# Altium schematic sheet DUO_X.SchDoc
size A3; SheetNumber: 1; SheetTotal: 8
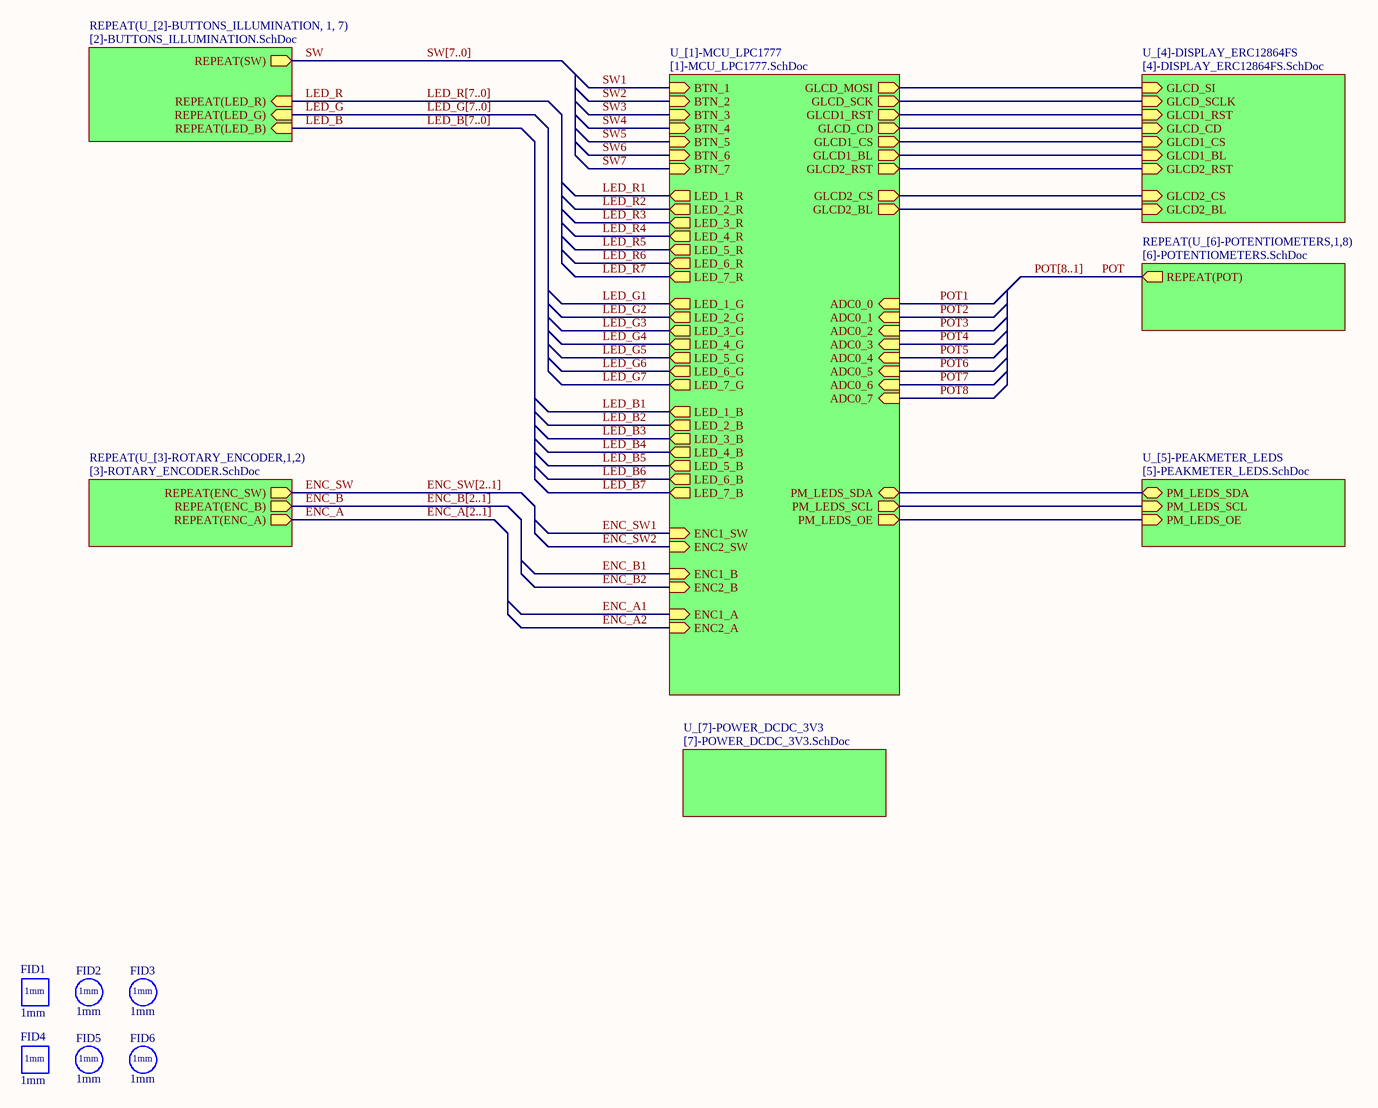
[diagram p0: DUO_X.SchDoc]

## Parts
FID1  1mm  [FID_1X2MM_R]
FID2  1mm  [FID_1X2MM_C]
FID3  1mm  [FID_1X2MM_C]
FID4  1mm  [FID_1X2MM_R]
FID5  1mm  [FID_1X2MM_C]
FID6  1mm  [FID_1X2MM_C]

## Sub-sheets
REPEAT(U_[2]-BUTTONS_ILLUMINATION, 1, 7) = [2]-BUTTONS_ILLUMINATION.SchDoc: REPEAT(SW) (out), REPEAT(LED_R) (in), REPEAT(LED_B) (in), REPEAT(LED_G) (in)
REPEAT(U_[3]-ROTARY_ENCODER,1,2) = [3]-ROTARY_ENCODER.SchDoc: REPEAT(ENC_SW) (out), REPEAT(ENC_B) (out), REPEAT(ENC_A) (out)
REPEAT(U_[6]-POTENTIOMETERS,1,8) = [6]-POTENTIOMETERS.SchDoc: REPEAT(POT) (out)
U_[1]-MCU_LPC1777 = [1]-MCU_LPC1777.SchDoc: ADC0_1 (in), ADC0_0 (in), ADC0_2 (in), ADC0_3 (in), ADC0_5 (in), ADC0_4 (in), ADC0_6 (in), ADC0_7 (in), GLCD_SCK (out), GLCD_MOSI (out), GLCD1_CS (out), GLCD1_BL (out), GLCD2_CS (out), GLCD2_RST (out), GLCD2_BL (out), PM_LEDS_OE (out), PM_LEDS_SCL (out), PM_LEDS_SDA (bidir), LED_1_R (out), LED_1_G (out), LED_1_B (out), BTN_1 (in), LED_2_R (out), LED_2_G (out), LED_2_B (out), BTN_2 (in), BTN_3 (in), LED_3_R (out), LED_3_G (out), LED_3_B (out), LED_4_R (out), LED_4_G (out), LED_4_B (out), BTN_4 (in), LED_5_R (out), LED_5_G (out), LED_5_B (out), BTN_5 (in), LED_6_R (out), LED_6_G (out), LED_6_B (out), BTN_6 (in), LED_7_R (out), LED_7_G (out), LED_7_B (out), BTN_7 (in), ENC1_A (in), ENC1_B (in), ENC1_SW (in), ENC2_A (in), ENC2_B (in), ENC2_SW (in), GLCD1_RST (out), GLCD_CD (out)
U_[4]-DISPLAY_ERC12864FS = [4]-DISPLAY_ERC12864FS.SchDoc: GLCD_SI (in), GLCD_SCLK (in), GLCD1_RST (in), GLCD1_CS (in), GLCD1_BL (in), GLCD2_RST (in), GLCD2_CS (in), GLCD2_BL (in), GLCD_CD (in)
U_[5]-PEAKMETER_LEDS = [5]-PEAKMETER_LEDS.SchDoc: PM_LEDS_SDA (bidir), PM_LEDS_SCL (in), PM_LEDS_OE (in)
U_[7]-POWER_DCDC_3V3 = [7]-POWER_DCDC_3V3.SchDoc: no entries

## Nets
ENC_A: sheet REPEAT(U_[3]-ROTARY_ENCODER,1,2)/REPEAT(ENC_A)
ENC_A1: sheet U_[1]-MCU_LPC1777/ENC1_A
ENC_A2: sheet U_[1]-MCU_LPC1777/ENC2_A
ENC_B: sheet REPEAT(U_[3]-ROTARY_ENCODER,1,2)/REPEAT(ENC_B)
ENC_B1: sheet U_[1]-MCU_LPC1777/ENC1_B
ENC_B2: sheet U_[1]-MCU_LPC1777/ENC2_B
ENC_SW: sheet REPEAT(U_[3]-ROTARY_ENCODER,1,2)/REPEAT(ENC_SW)
ENC_SW1: sheet U_[1]-MCU_LPC1777/ENC1_SW
ENC_SW2: sheet U_[1]-MCU_LPC1777/ENC2_SW
LED_B: sheet REPEAT(U_[2]-BUTTONS_ILLUMINATION, 1, 7)/REPEAT(LED_B)
LED_B1: sheet U_[1]-MCU_LPC1777/LED_1_B
LED_B2: sheet U_[1]-MCU_LPC1777/LED_2_B
LED_B3: sheet U_[1]-MCU_LPC1777/LED_3_B
LED_B4: sheet U_[1]-MCU_LPC1777/LED_4_B
LED_B5: sheet U_[1]-MCU_LPC1777/LED_5_B
LED_B6: sheet U_[1]-MCU_LPC1777/LED_6_B
LED_B7: sheet U_[1]-MCU_LPC1777/LED_7_B
LED_G: sheet REPEAT(U_[2]-BUTTONS_ILLUMINATION, 1, 7)/REPEAT(LED_G)
LED_G1: sheet U_[1]-MCU_LPC1777/LED_1_G
LED_G2: sheet U_[1]-MCU_LPC1777/LED_2_G
LED_G3: sheet U_[1]-MCU_LPC1777/LED_3_G
LED_G4: sheet U_[1]-MCU_LPC1777/LED_4_G
LED_G5: sheet U_[1]-MCU_LPC1777/LED_5_G
LED_G6: sheet U_[1]-MCU_LPC1777/LED_6_G
LED_G7: sheet U_[1]-MCU_LPC1777/LED_7_G
LED_R: sheet REPEAT(U_[2]-BUTTONS_ILLUMINATION, 1, 7)/REPEAT(LED_R)
LED_R1: sheet U_[1]-MCU_LPC1777/LED_1_R
LED_R2: sheet U_[1]-MCU_LPC1777/LED_2_R
LED_R3: sheet U_[1]-MCU_LPC1777/LED_3_R
LED_R4: sheet U_[1]-MCU_LPC1777/LED_4_R
LED_R5: sheet U_[1]-MCU_LPC1777/LED_5_R
LED_R6: sheet U_[1]-MCU_LPC1777/LED_6_R
LED_R7: sheet U_[1]-MCU_LPC1777/LED_7_R
POT: sheet REPEAT(U_[6]-POTENTIOMETERS,1,8)/REPEAT(POT)
POT1: sheet U_[1]-MCU_LPC1777/ADC0_0
POT2: sheet U_[1]-MCU_LPC1777/ADC0_1
POT3: sheet U_[1]-MCU_LPC1777/ADC0_2
POT4: sheet U_[1]-MCU_LPC1777/ADC0_3
POT5: sheet U_[1]-MCU_LPC1777/ADC0_4
POT6: sheet U_[1]-MCU_LPC1777/ADC0_5
POT7: sheet U_[1]-MCU_LPC1777/ADC0_6
POT8: sheet U_[1]-MCU_LPC1777/ADC0_7
SW: sheet REPEAT(U_[2]-BUTTONS_ILLUMINATION, 1, 7)/REPEAT(SW)
SW1: sheet U_[1]-MCU_LPC1777/BTN_1
SW2: sheet U_[1]-MCU_LPC1777/BTN_2
SW3: sheet U_[1]-MCU_LPC1777/BTN_3
SW4: sheet U_[1]-MCU_LPC1777/BTN_4
SW5: sheet U_[1]-MCU_LPC1777/BTN_5
SW6: sheet U_[1]-MCU_LPC1777/BTN_6
SW7: sheet U_[1]-MCU_LPC1777/BTN_7
(unnamed): sheet U_[1]-MCU_LPC1777/GLCD_SCK, sheet U_[4]-DISPLAY_ERC12864FS/GLCD_SCLK
(unnamed): sheet U_[1]-MCU_LPC1777/GLCD_MOSI, sheet U_[4]-DISPLAY_ERC12864FS/GLCD_SI
(unnamed): sheet U_[1]-MCU_LPC1777/GLCD1_CS, sheet U_[4]-DISPLAY_ERC12864FS/GLCD1_CS
(unnamed): sheet U_[1]-MCU_LPC1777/GLCD1_BL, sheet U_[4]-DISPLAY_ERC12864FS/GLCD1_BL
(unnamed): sheet U_[1]-MCU_LPC1777/GLCD2_CS, sheet U_[4]-DISPLAY_ERC12864FS/GLCD2_CS
(unnamed): sheet U_[1]-MCU_LPC1777/GLCD2_RST, sheet U_[4]-DISPLAY_ERC12864FS/GLCD2_RST
(unnamed): sheet U_[1]-MCU_LPC1777/GLCD2_BL, sheet U_[4]-DISPLAY_ERC12864FS/GLCD2_BL
(unnamed): sheet U_[1]-MCU_LPC1777/PM_LEDS_OE, sheet U_[5]-PEAKMETER_LEDS/PM_LEDS_OE
(unnamed): sheet U_[1]-MCU_LPC1777/PM_LEDS_SCL, sheet U_[5]-PEAKMETER_LEDS/PM_LEDS_SCL
(unnamed): sheet U_[1]-MCU_LPC1777/PM_LEDS_SDA, sheet U_[5]-PEAKMETER_LEDS/PM_LEDS_SDA
(unnamed): sheet U_[1]-MCU_LPC1777/GLCD1_RST, sheet U_[4]-DISPLAY_ERC12864FS/GLCD1_RST
(unnamed): sheet U_[1]-MCU_LPC1777/GLCD_CD, sheet U_[4]-DISPLAY_ERC12864FS/GLCD_CD

## Buses and harness runs
bus ENC_A[2..1]
bus ENC_B[2..1]
bus ENC_SW[2..1]
bus LED_B[7..0]
bus LED_G[7..0]
bus LED_R[7..0]
bus POT[8..1]
bus SW[7..0]

## Library data of the parts
FID1 FID4 = FID_RECT_1MM: FIDUCIAL RECTANGLE 1MM-2MM
FID2 FID3 FID5 FID6 = FID_ROUND_1MM: FIDUCIAL ROUND 1MM-2MM